# Altium project SINUX_V3.PrjPcb
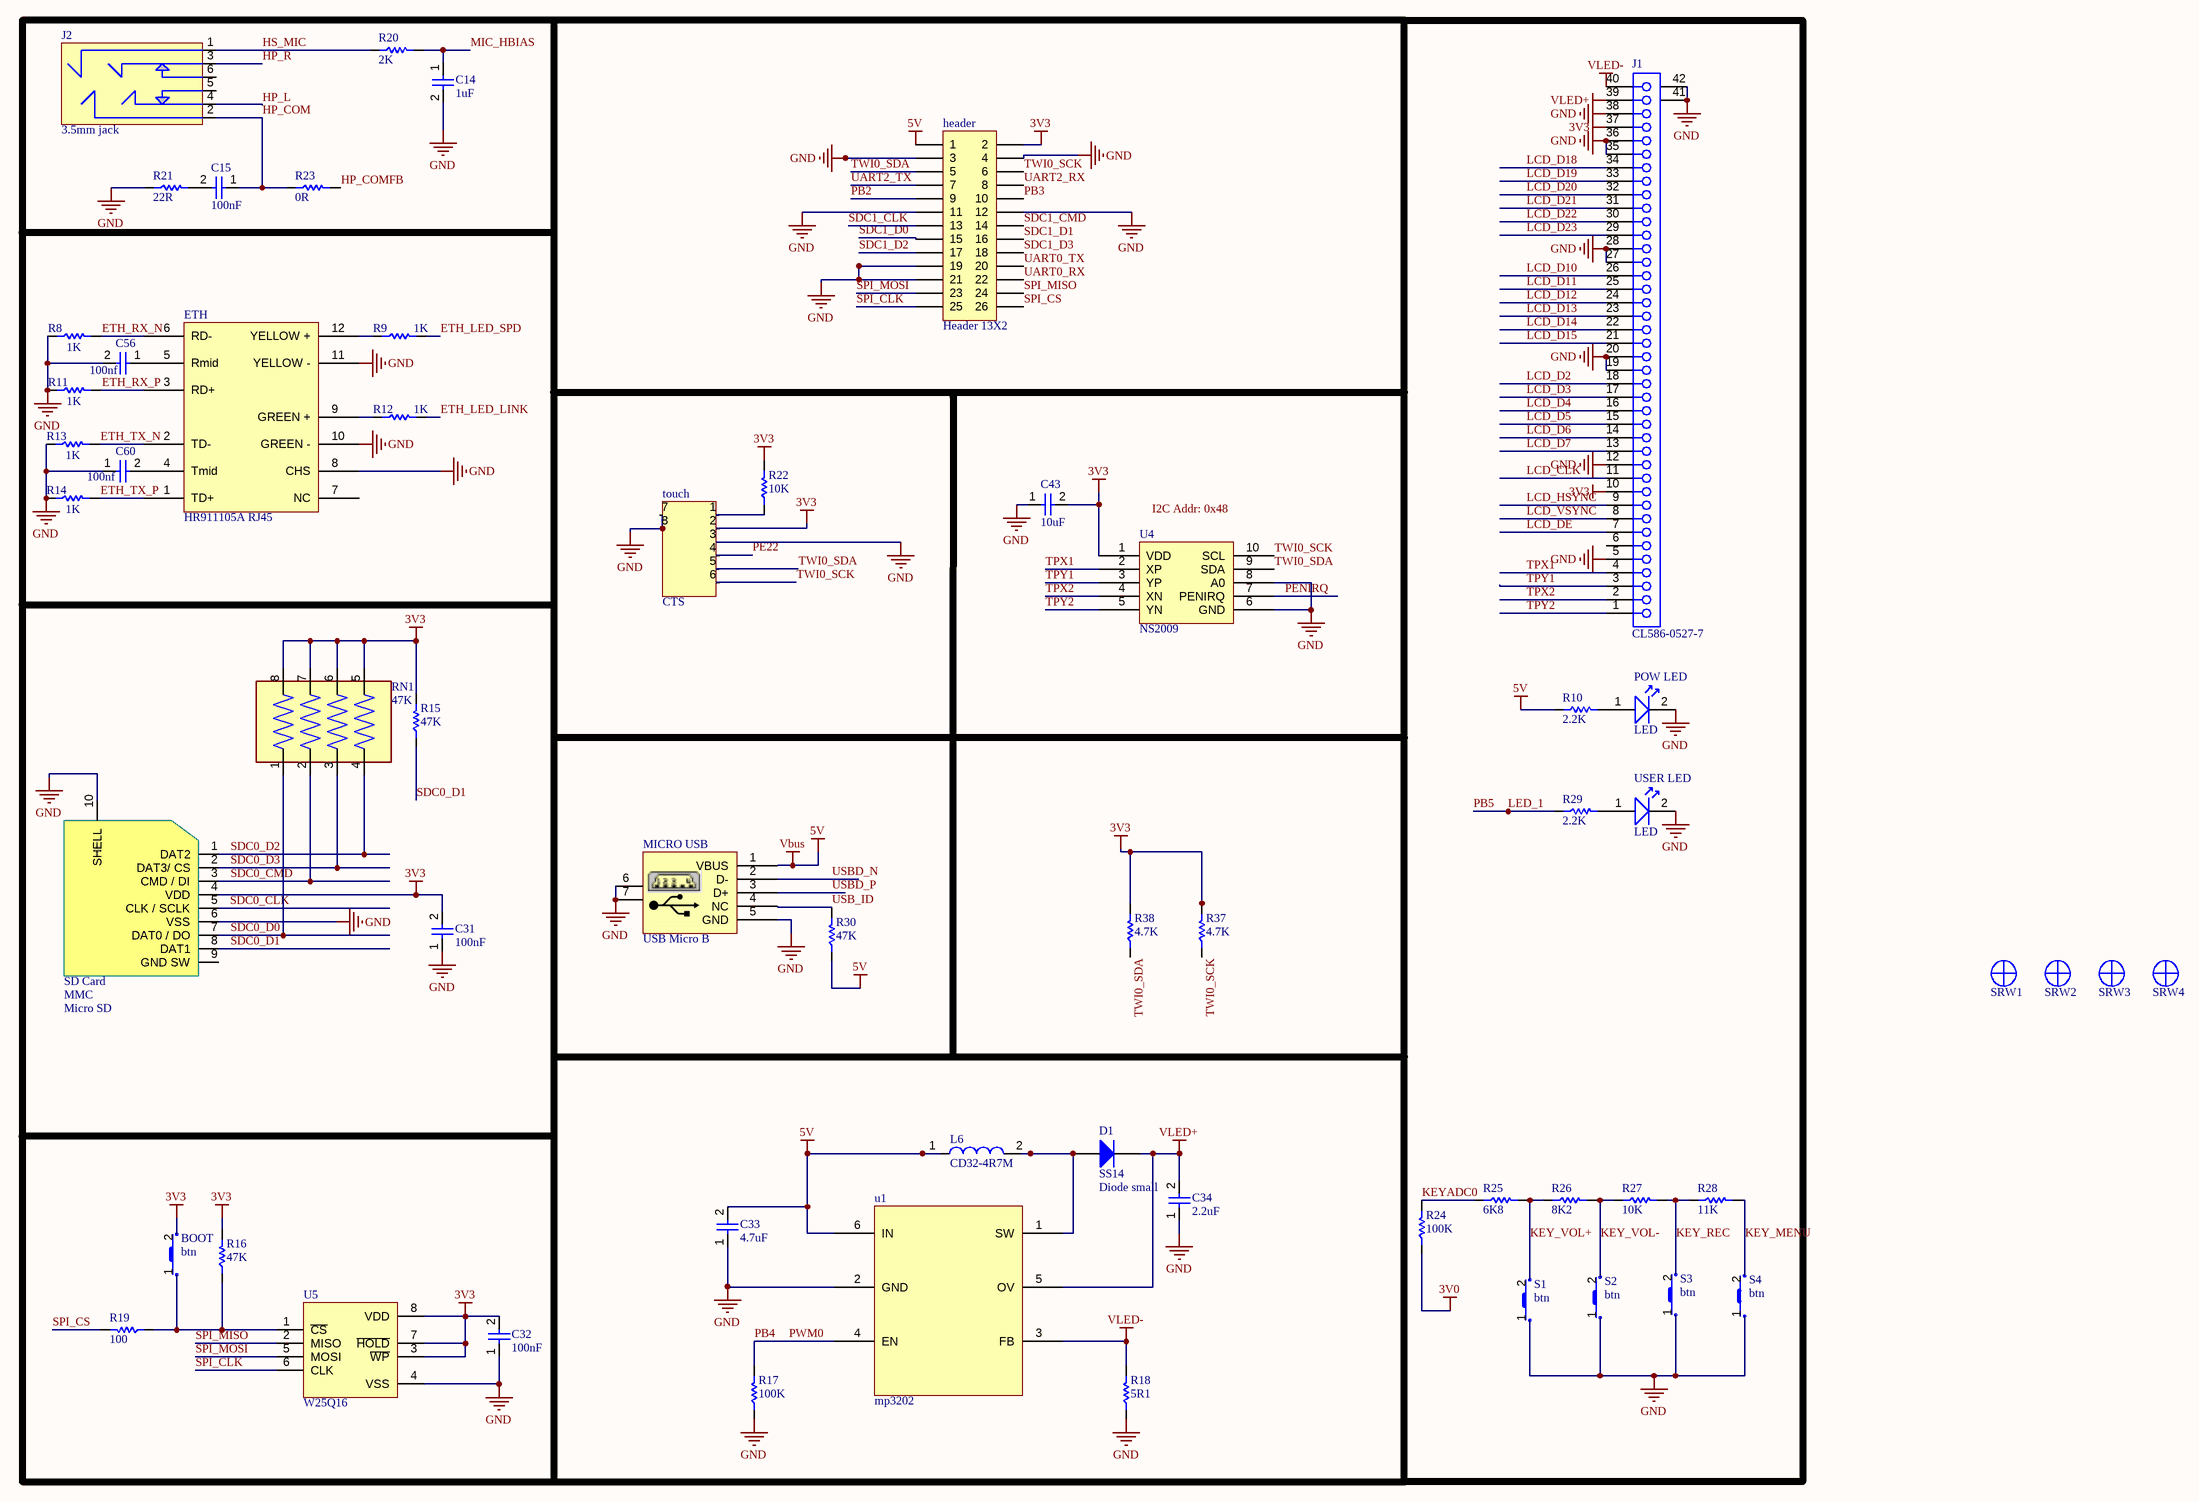
[diagram p0: SINUX_V3_IO.SchDoc]
3 sheets, 131 parts. Net scope: global (net labels, ports and power ports of the same name join across sheets).
Board file: SINUX_V3.PcbDoc
Sheets:
  SINUX_V3_IO.SchDoc
  SINUX_V3_MAIN.SchDoc
  SINUX_V3_POWER.SchDoc

## Sheet SINUX_V3_IO.SchDoc
size 594 x 420 mm

### Parts
BOOT  btn  [btn]
C14  1uF  [SMD 0805]
C15  100nF  [SMD 0805]
C31  100nF  [SMD 0805]
C32  100nF  [SMD 0805]
C33  4.7uF  [SMD 0805]
C34  2.2uF  [SMD 0805]
C43  10uF  [SMD 0805]
C56  100nf  [SMD 0805]
C60  100nf  [SMD 0805]
D1  SS14  [Diode small SMD]
ETH  HR911105A RJ45  [HR911105A]
header  Header 13X2  [HDR2X13]
J1  CL586-0527-7  [FH12-40S-0.5SH]
J2  3.5mm jack  [3.5mm jack 6 pin]
L6  CD32-4R7M  [CD324R7M]
MICRO_USB  USB Micro B  [USB mini]
POW_LED  LED  [0805 LED]
R8  1K  [0805_1/8W]
R9  1K  [0805_1/8W]
R10  2.2K  [0805_1/8W]
R11  1K  [0805_1/8W]
R12  1K  [0805_1/8W]
R13  1K  [0805_1/8W]
R14  1K  [0805_1/8W]
R15  47K  [0805_1/8W]
R16  47K  [0805_1/8W]
R17  100K  [0805_1/8W]
R18  5R1  [0805_1/8W]
R19  100  [0805_1/8W]
R20  2K  [0805_1/8W]
R21  22R  [0805_1/8W]
R22  10K  [0805_1/8W]
R23  0R  [0805_1/8W]
R24  100K  [0805_1/8W]
R25  6K8  [0805_1/8W]
R26  8K2  [0805_1/8W]
R27  10K  [0805_1/8W]
R28  11K  [0805_1/8W]
R29  2.2K  [0805_1/8W]
R30  47K  [0805_1/8W]
R37  4.7K  [0805_1/8W]
R38  4.7K  [0805_1/8W]
RN1  47K  [RESCAF80P320X160X60-8N]
S1  btn  [btn]
S2  btn  [btn]
S3  btn  [btn]
S4  btn  [btn]
SD_Card  MMC  [Micro SD holder]
SRW1  Screw  [Board Screw]  (value not drawn)
SRW2  Screw  [Board Screw]  (value not drawn)
SRW3  Screw  [Board Screw]  (value not drawn)
SRW4  Screw  [Board Screw]  (value not drawn)
touch  CTS  [TS]
u1  mp3202  [SOP95P275X110-6N]
U4  NS2009  [SOP50P490X110-11N]
U5  W25Q16  [SOIC 8-Lead  (5.08mm)]
USER_LED  LED  [0805 LED]

### Nets
3V0: R24.1
3V3: BOOT.2 C31.2 C32.2 C43.2 header.2 J1.10 J1.37 R15.2 R16.2 R22.2 R37.2 R38.2 RN1.5 RN1.6 RN1.7 RN1.8 SD_Card.4(VDD) touch.2 U4.1(VDD) U5.3(~{WP}) U5.7(~{HOLD}) U5.8(VDD)
5V: C33.2 header.1 L6.1 MICRO_USB.1(VBUS) R10.1 R30.1 u1.6(IN)  [also labelled Vbus]
GND: C14.2 C31.1 C32.1 C33.1 C34.1 C43.1 C56.2 C60.1 ETH.8(CHS) ETH.10(GREEN_-) ETH.11(YELLOW_-) header.3 header.4 header.11 header.12 header.19 header.21 J1.5 J1.12 J1.19 J1.20 J1.27 J1.28 J1.35 J1.36 J1.38 J1.41(MH1) J1.42(MH2) MICRO_USB.5(GND) MICRO_USB.6 MICRO_USB.7 POW_LED.2 R8.1 R11.1 R13.1 R14.1 R17.1 R18.1 R21.1 S1.1 S2.1 S3.1 S4.1 SD_Card.6(VSS) SD_Card.10(SHELL) touch.3 touch.7 touch.8 u1.2(GND) U4.6(GND) U4.8(A0) U5.4(VSS) USER_LED.2
VLED+: C34.2 D1.2(K) J1.39 u1.5(OV)
VLED-: J1.40 R18.2 u1.3(FB)
ETH_LED_LINK: R12.2
ETH_LED_SPD: R9.2
ETH_RX_N: ETH.6(RD-) R8.2
ETH_RX_P: ETH.3(RD+) R11.2
ETH_TX_N: ETH.2(TD-) R13.2
ETH_TX_P: ETH.1(TD+) R14.2
HP_COM: C15.1 J2.2 R23.1
HP_COMFB: R23.2
HP_L: J2.4
HP_R: J2.3
HS_MIC: J2.1 R20.1
KEY_MENU: R28.2 S4.2
KEY_REC: R27.2 R28.1 S3.2
KEY_VOL+: R25.2 R26.1 S1.2
KEY_VOL-: R26.2 R27.1 S2.2
KEYADC0: R24.2 R25.1
LCD_CLK: J1.11
LCD_D2: J1.18
LCD_D3: J1.17
LCD_D4: J1.16
LCD_D5: J1.15
LCD_D6: J1.14
LCD_D7: J1.13
LCD_D10: J1.26
LCD_D11: J1.25
LCD_D12: J1.24
LCD_D13: J1.23
LCD_D14: J1.22
LCD_D15: J1.21
LCD_D18: J1.34
LCD_D19: J1.33
LCD_D20: J1.32
LCD_D21: J1.31
LCD_D22: J1.30
LCD_D23: J1.29
LCD_DE: J1.7
LCD_HSYNC: J1.9
LCD_VSYNC: J1.8
LED_1: R29.1  [also labelled PB5]
MIC_HBIAS: C14.1 R20.2
PB2: header.9
PB3: header.10
PB4: R17.2 u1.4(EN)  [also labelled PWM0]
PE22: touch.4
PENIRQ: U4.7(PENIRQ)
SDC0_CLK: SD_Card.5(CLK_/_SCLK)
SDC0_CMD: RN1.2 SD_Card.3(CMD_/_DI)
SDC0_D0: RN1.1 SD_Card.7(DAT0_/_DO)
SDC0_D1: R15.1 SD_Card.8(DAT1)
SDC0_D2: RN1.4 SD_Card.1(DAT2)
SDC0_D3: RN1.3 SD_Card.2(DAT3/_CS)
SDC1_CLK: header.13
SDC1_CMD: header.14
SDC1_D0: header.15
SDC1_D1: header.16
SDC1_D2: header.17
SDC1_D3: header.18
SPI_CLK: header.25 U5.6(CLK)
SPI_CS: header.26 R19.2
SPI_MISO: header.24 U5.2(MISO)
SPI_MOSI: header.23 U5.5(MOSI)
TPX1: J1.4 U4.2(XP)
TPX2: J1.2 U4.4(XN)
TPY1: J1.3 U4.3(YP)
TPY2: J1.1 U4.5(YN)
TWI0_SCK: header.6 R37.1 touch.6 U4.10(SCL)
TWI0_SDA: header.5 R38.1 touch.5 U4.9(SDA)
UART0_RX: header.22
UART0_TX: header.20
UART2_RX: header.8
UART2_TX: header.7
USB_ID: MICRO_USB.4(NC) R30.2
USBD_N: MICRO_USB.2(D-)
USBD_P: MICRO_USB.3(D+)
NetBOOT_1: BOOT.1 R16.1 R19.1 U5.1(~{CS})
NetC15_2: C15.2 R21.2
NetC56_1: C56.1 ETH.5(Rmid)
NetC60_2: C60.2 ETH.4(Tmid)
NetD1_1: D1.1(A) L6.2 u1.1(SW)
NetETH_9: ETH.9(GREEN_+) R12.1
NetETH_12: ETH.12(YELLOW_+) R9.1
NetPOW_LED_1: POW_LED.1 R10.2
NetR22_1: R22.1 touch.1
NetR29_2: R29.2 USER_LED.1

Not connected (* = marked no-connect by the designer): ETH 7(NC); J1 6; J2 5 6; SD_Card 9(GND_SW)

### Notes on the sheet
- Labels drawn without touching a wire or pin: I2C Addr: 0x48
- DWG NO:
- REV:
- THIS DOCUMENT AND THE DATA DISCLOSED HEREIN OR
- HEREWITH IS THE PROPERTY OF ALTIUM LIMITED AND MAY
- BE FREELY DISTRIBUTED IN WHOLE. NO RIGHTS ARE
- RESERVED OR EXPRESS OR IMPLIED WARANTEE GIVEN.
- REVISION
- DESCRIPTION
- DATE
- APPROVED
- ENG:
- APPROVALS
- PROJECT
- DSN:
- CHK:
- REFERENCE DOCUMENTS
- PROJECT REVISION:
- TITLE
- DOCUMENT REVISION:
- DESIGN ITEM:
- BOM:
- FAB DWG:
- PCB DWG:
- ASSY DWG:
- SCALE:
- A2
- SIZE
- CAGE CODE
- FILE NAME
- DWG NO.
- SHEET
- OF
- REV
- (in symbol Diode) Diode small
- (in symbol MMC) Micro SD

### Library data of the parts
C14 C15 C32-C34 = CAP NON: Capacitor; Manufacturer Part Number 1: 10uF; Supplier 1: SMD-0805
C31 C43 C56 C60 = CAP NON
D1 = Diode
header = Header 13X2: Header, 13-Pin, Dual row; LatestRevisionDate: 17-Jul-2002; LatestRevisionNote: Re-released for DXP Platform.; Publisher: Altium Limited
J1 = CL586-0527-7: FH12 Series, "Flip-Lock" SMT/ZIF FFC/FPC Connector - 0.5mm Spaced Bottom Contact; Positions: 40; ContactMaterial: Phosphor Bronze; Current: 0.4A; PCB_Layout: Complies with manufacturer's recommendation.; Published: 17-Jul-2002; DatasheetVersion: 13-Nov-2000; PackageVersion: 13-Nov-2000; PackageReference: FH12-40S-0.5SH; Publisher: Altium Limited; PadDimensions: Follow nominal values, Suitable for Wave Soldering, Adjust for Re-flow.; ComponentLink1Description: Manufacturer Link; ComponentLink1URL: http://www.hiroseusa.com/; ComponentLink2Description: Datasheet; ComponentLink2URL: http://www.hirose.co.jp/cataloge_hp/e58605370.pdf
L6 = CD32-4R7M: Inductor; Manufacturer_Name: Shuo Xing; Datasheet Link: http://aitendo3.sakura.ne.jp/aitendo_data/product_img/parts/coil/CD32/CD32.pdf; Height: 2.4mm; Manufacturer_Part_Number: CD32-4R7M
R8-R30 R37 R38 = RESISTOR
RN1 = CAY16-270J4LF: 27 Ohm Â±5% 62.5mW Power Per Element Isolated Resistor Network/Array Â±200ppm/Â°C 1206 (3216 Metric), Convex, Long Side Terminals; MF: Bourns; Purchase-URL: https://pricing.snapeda.com/search/part/CAY16-270J4LF/?ref=eda; MP: CAY16-270J4LF; Package: 1206 Bourns; Price: None; Availability: Good; SnapEDA_Link: https://www.snapeda.com/parts/CAY16-270J4LF/Bourns/view-part/1118422/?ref=snap; Value: *; Check_prices: https://www.snapeda.com/parts/CAY16-270J4LF/Bourns/view-part/1118422/?ref=eda
SRW1-SRW4 = Board Screw 3MM: Board Screw With Spacer
U5 = SST25VF032: SERIAL FLASH MEMORY; Manufacturer Part Number 1: W25Q32JV-DTR; Manufacturer 1: Winbond; Supplier 1: 8-Pin SOIC 208-mil

## Sheet SINUX_V3_MAIN.SchDoc
size 594 x 420 mm
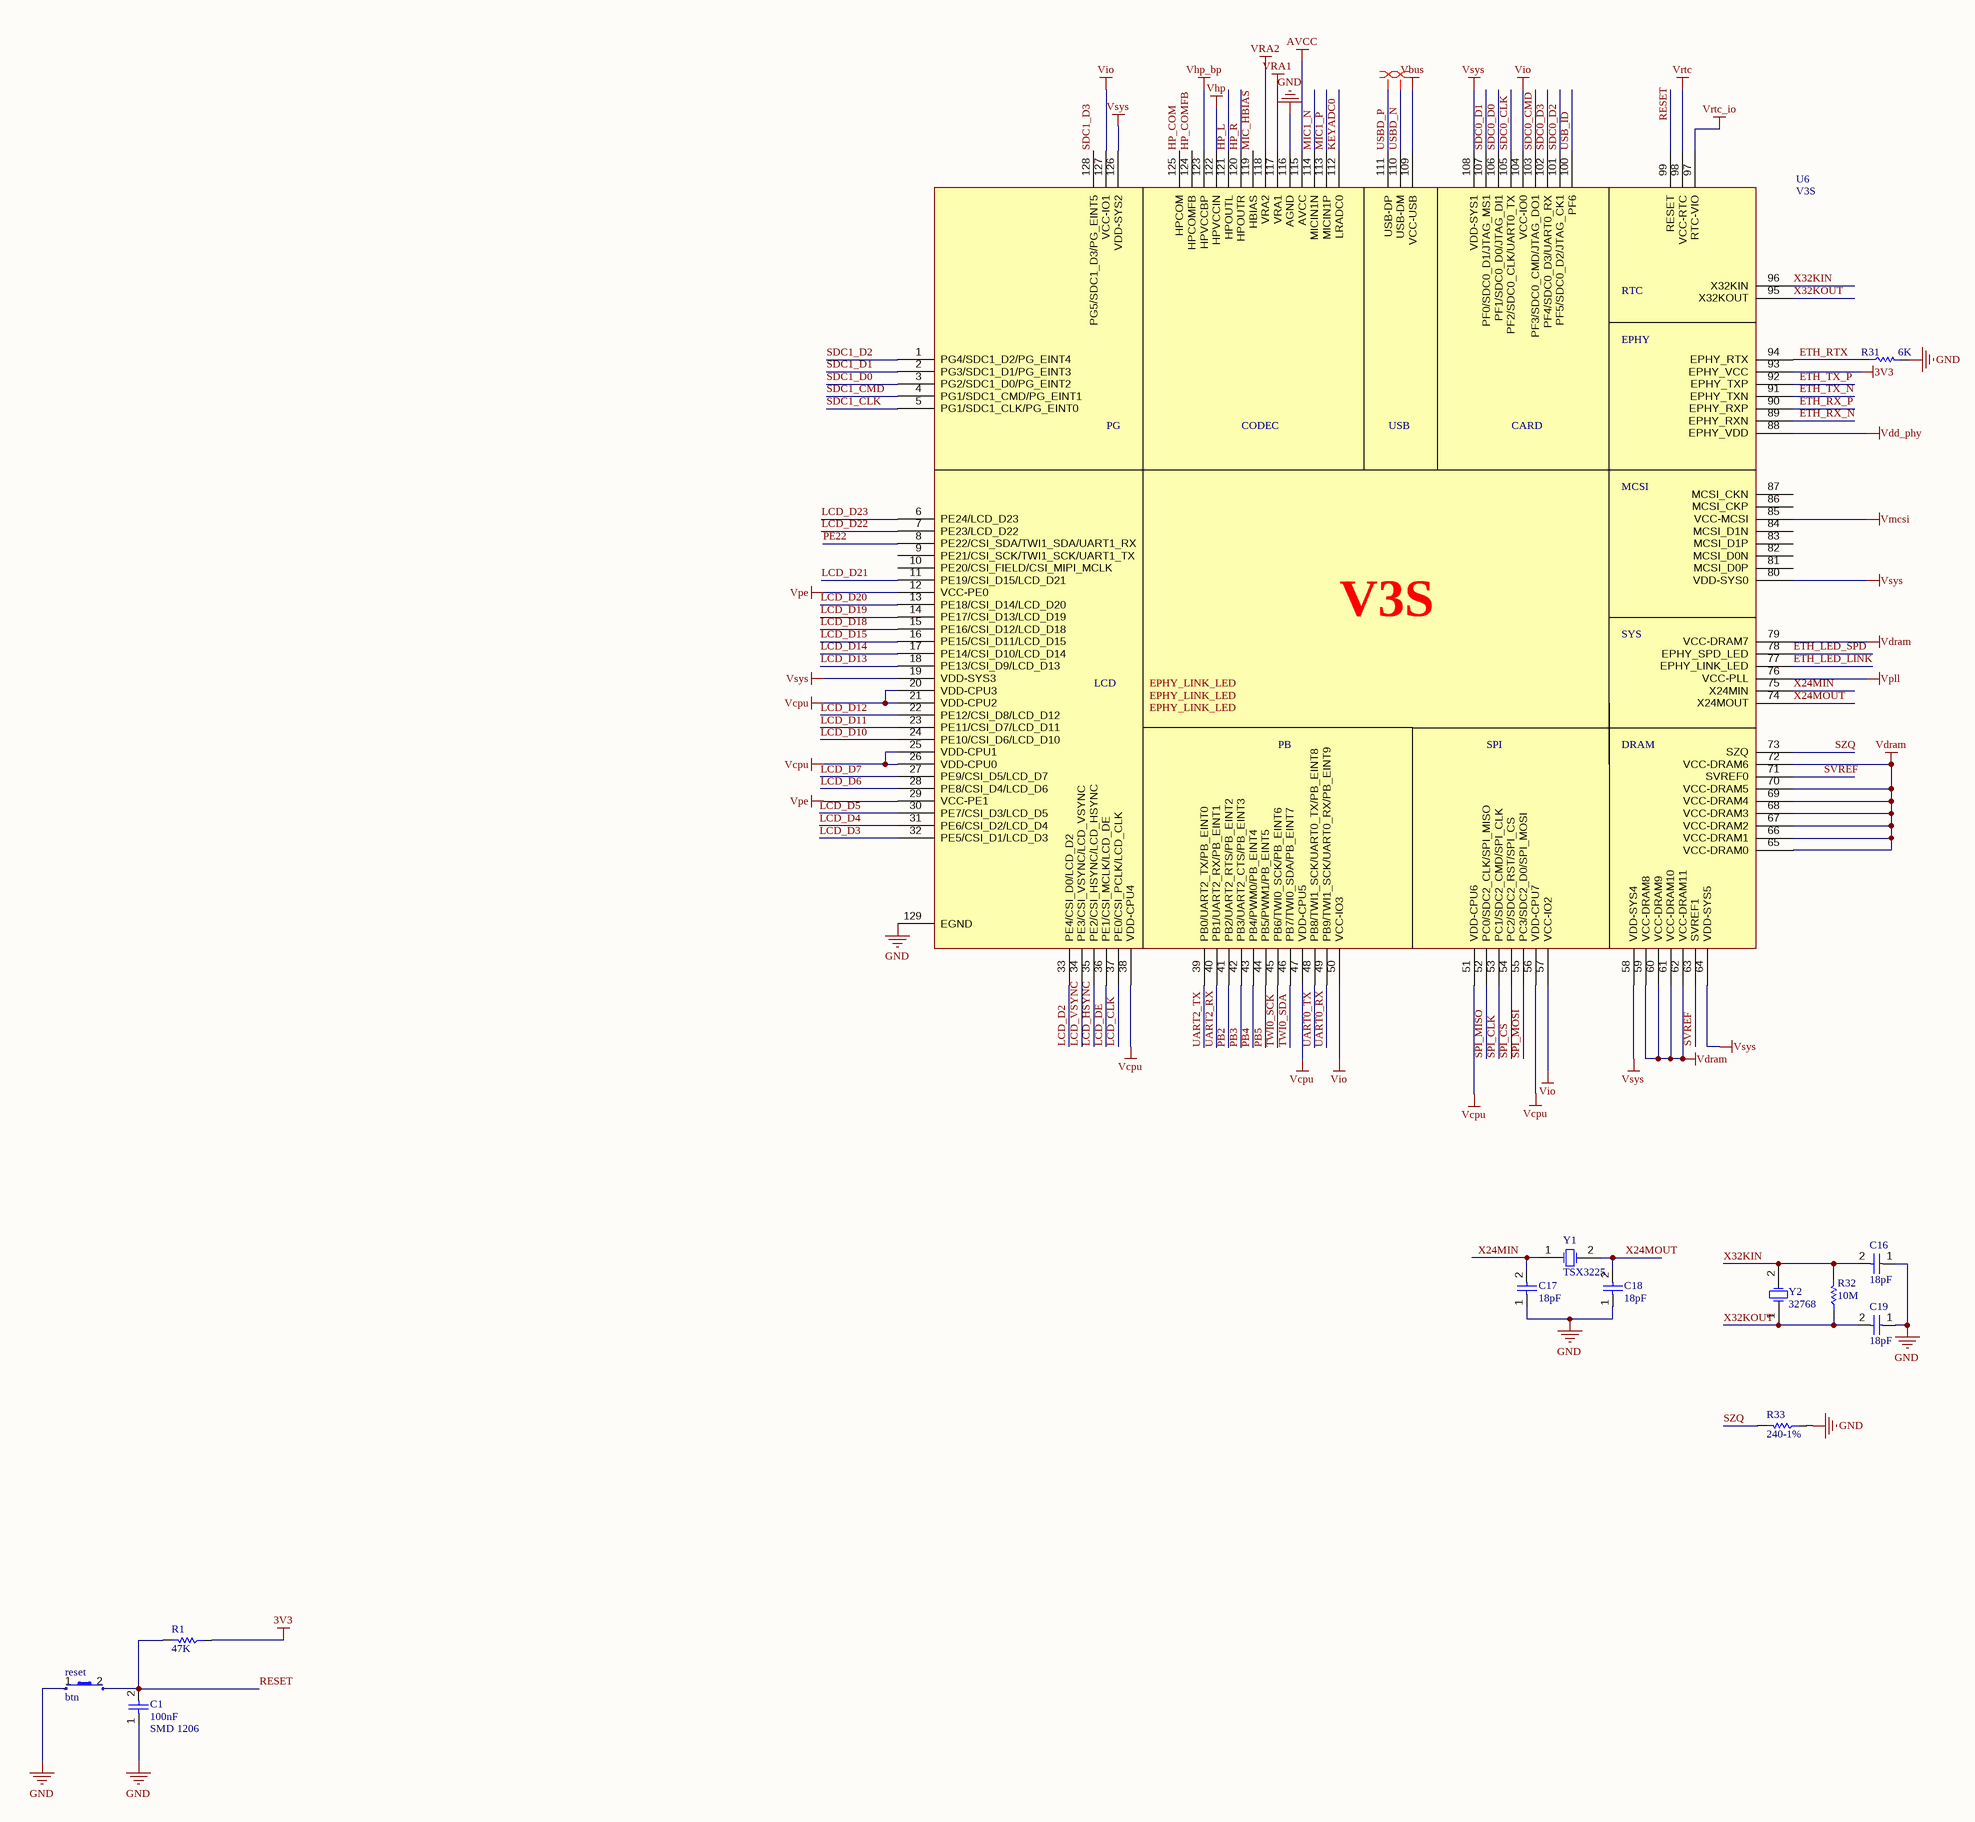
[diagram p1: SINUX_V3_MAIN.SchDoc]

### Parts
C1  100nF  [SMD 0805]
C16  18pF  [SMD 0805]
C17  18pF  [SMD 0805]
C18  18pF  [SMD 0805]
C19  18pF  [SMD 0805]
R1  47K  [0805_1/8W]
R31  6K  [0805_1/8W]
R32  10M  [0805_1/8W]
R33  240-1%  [0805_1/8W]
reset  btn  [btn]
U6  V3S  [V3S]
Y1  TSX3225  [XTAL  SMD]
Y2  32768  [XTAL RTC]

### Nets
3V3: R1.1 U6.12(VCC-PE0) U6.29(VCC-PE1) U6.50(VCC-IO3) U6.57(VCC-IO2) U6.85(VCC-MCSI) U6.93(EPHY_VCC) U6.98(VCC-RTC) U6.104(VCC-IO0) U6.122(HPVCCIN) U6.127(VCC-IO1)  [also labelled Vhp, Vio, Vmcsi, Vpe, Vrtc]
AVCC: U6.76(VCC-PLL) U6.115(AVCC)  [also labelled Vpll]  [project net 3V0]
GND: C1.1 C16.1 C17.1 C18.1 C19.1 R31.2 R33.1 reset.1 U6.116(AGND) U6.129(EGND)
Vbus: U6.109(VCC-USB)  [project net 5V]
Vcpu: U6.19(VDD-SYS3) U6.20(VDD-CPU3) U6.21(VDD-CPU2) U6.25(VDD-CPU1) U6.26(VDD-CPU0) U6.38(VDD-CPU4) U6.47(VDD-CPU5) U6.51(VDD-CPU6) U6.56(VDD-CPU7) U6.58(VDD-SYS4) U6.64(VDD-SYS5) U6.80(VDD-SYS0) U6.88(EPHY_VDD) U6.108(VDD-SYS1) U6.126(VDD-SYS2)  [also labelled Vdd_phy, Vsys]  [project net 1V2]
Vdram: U6.59(VCC-DRAM8) U6.60(VCC-DRAM9) U6.61(VCC-DRAM10) U6.62(VCC-DRAM11) U6.65(VCC-DRAM0) U6.66(VCC-DRAM1) U6.67(VCC-DRAM2) U6.68(VCC-DRAM3) U6.69(VCC-DRAM4) U6.70(VCC-DRAM5) U6.72(VCC-DRAM6) U6.79(VCC-DRAM7)  [project net 1V8]
Vhp_bp: U6.123(HPVCCBP)
VRA1: U6.117(VRA1)
VRA2: U6.118(VRA2)
Vrtc_io: U6.97(RTC-VIO)
ETH_LED_LINK: U6.77(EPHY_LINK_LED)
ETH_LED_SPD: U6.78(EPHY_SPD_LED)
ETH_RTX: R31.1 U6.94(EPHY_RTX)
ETH_RX_N: U6.89(EPHY_RXN)
ETH_RX_P: U6.90(EPHY_RXP)
ETH_TX_N: U6.91(EPHY_TXN)
ETH_TX_P: U6.92(EPHY_TXP)
HP_COM: U6.125(HPCOM)
HP_COMFB: U6.124(HPCOMFB)
HP_L: U6.121(HPOUTL)
HP_R: U6.120(HPOUTR)
KEYADC0: U6.112(LRADC0)
LCD_CLK: U6.37(PE0/CSI_PCLK/LCD_CLK)
LCD_D2: U6.33(PE4/CSI_D0/LCD_D2)
LCD_D3: U6.32(PE5/CSI_D1/LCD_D3)
LCD_D4: U6.31(PE6/CSI_D2/LCD_D4)
LCD_D5: U6.30(PE7/CSI_D3/LCD_D5)
LCD_D6: U6.28(PE8/CSI_D4/LCD_D6)
LCD_D7: U6.27(PE9/CSI_D5/LCD_D7)
LCD_D10: U6.24(PE10/CSI_D6/LCD_D10)
LCD_D11: U6.23(PE11/CSI_D7/LCD_D11)
LCD_D12: U6.22(PE12/CSI_D8/LCD_D12)
LCD_D13: U6.18(PE13/CSI_D9/LCD_D13)
LCD_D14: U6.17(PE14/CSI_D10/LCD_D14)
LCD_D15: U6.16(PE15/CSI_D11/LCD_D15)
LCD_D18: U6.15(PE16/CSI_D12/LCD_D18)
LCD_D19: U6.14(PE17/CSI_D13/LCD_D19)
LCD_D20: U6.13(PE18/CSI_D14/LCD_D20)
LCD_D21: U6.11(PE19/CSI_D15/LCD_D21)
LCD_D22: U6.7(PE23/LCD_D22)
LCD_D23: U6.6(PE24/LCD_D23)
LCD_DE: U6.36(PE1/CSI_MCLK/LCD_DE)
LCD_HSYNC: U6.35(PE2/CSI_HSYNC/LCD_HSYNC)
LCD_VSYNC: U6.34(PE3/CSI_VSYNC/LCD_VSYNC)
MIC1_N: U6.114(MICIN1N)
MIC1_P: U6.113(MICIN1P)
MIC_HBIAS: U6.119(HBIAS)
PB2: U6.41(PB2/UART2_RTS/PB_EINT2)
PB3: U6.42(PB3/UART2_CTS/PB_EINT3)
PB4: U6.43(PB4/PWM0/PB_EINT4)
PB5: U6.44(PB5/PWM1/PB_EINT5)  [project net LED_1]
PE22: U6.8(PE22/CSI_SDA/TWI1_SDA/UART1_RX)
RESET: C1.2 R1.2 reset.2 U6.99(RESET)
SDC0_CLK: U6.105(PF2/SDC0_CLK/UART0_TX)
SDC0_CMD: U6.103(PF3/SDC0_CMD/JTAG_DO1)
SDC0_D0: U6.106(PF1/SDC0_D0/JTAG_DI1)
SDC0_D1: U6.107(PF0/SDC0_D1/JTAG_MS1)
SDC0_D2: U6.101(PF5/SDC0_D2/JTAG_CK1)
SDC0_D3: U6.102(PF4/SDC0_D3/UART0_RX)
SDC1_CLK: U6.5(PG1/SDC1_CLK/PG_EINT0)
SDC1_CMD: U6.4(PG1/SDC1_CMD/PG_EINT1)
SDC1_D0: U6.3(PG2/SDC1_D0/PG_EINT2)
SDC1_D1: U6.2(PG3/SDC1_D1/PG_EINT3)
SDC1_D2: U6.1(PG4/SDC1_D2/PG_EINT4)
SDC1_D3: U6.128(PG5/SDC1_D3/PG_EINT5)
SPI_CLK: U6.53(PC1/SDC2_CMD/SPI_CLK)
SPI_CS: U6.54(PC2/SDC2_RST/SPI_CS)
SPI_MISO: U6.52(PC0/SDC2_CLK/SPI_MISO)
SPI_MOSI: U6.55(PC3/SDC2_D0/SPI_MOSI)
SVREF: U6.63(SVREF1) U6.71(SVREF0)
SZQ: R33.2 U6.73(SZQ)
TWI0_SCK: U6.45(PB6/TWI0_SCK/PB_EINT6)
TWI0_SDA: U6.46(PB7/TWI0_SDA/PB_EINT7)
UART0_RX: U6.49(PB9/TWI1_SCK/UART0_RX/PB_EINT9)
UART0_TX: U6.48(PB8/TWI1_SCK/UART0_TX/PB_EINT8)
UART2_RX: U6.40(PB1/UART2_RX/PB_EINT1)
UART2_TX: U6.39(PB0/UART2_TX/PB_EINT0)
USB_ID: U6.100(PF6)
USBD_N: U6.110(USB-DM)
USBD_P: U6.111(USB-DP)
X24MIN: C17.2 U6.75(X24MIN) Y1.1(OSC1)
X24MOUT: C18.2 U6.74(X24MOUT) Y1.2(OSC2)
X32KIN: C16.2 R32.2 U6.96(X32KIN) Y2.2(OSC2)
X32KOUT: C19.2 R32.1 U6.95(X32KOUT) Y2.1(OSC1)

Not connected (* = marked no-connect by the designer): U6 9(PE21/CSI_SCK/TWI1_SCK/UART1_TX) 10(PE20/CSI_FIELD/CSI_MIPI_MCLK) 81(MCSI_D0P) 82(MCSI_D0N) 83(MCSI_D1P) 84(MCSI_D1N) 86(MCSI_CKP) 87(MCSI_CKN)

### Layout directives
differential pair: USBD_N, USBD_P

### Notes on the sheet
- Labels drawn without touching a wire or pin: EPHY_LINK_LED
- DWG NO:
- REV:
- THIS DOCUMENT AND THE DATA DISCLOSED HEREIN OR
- HEREWITH IS THE PROPERTY OF ALTIUM LIMITED AND MAY
- BE FREELY DISTRIBUTED IN WHOLE. NO RIGHTS ARE
- RESERVED OR EXPRESS OR IMPLIED WARANTEE GIVEN.
- REVISION
- DESCRIPTION
- DATE
- APPROVED
- ENG:
- APPROVALS
- PROJECT
- DSN:
- CHK:
- REFERENCE DOCUMENTS
- PROJECT REVISION:
- TITLE
- DOCUMENT REVISION:
- DESIGN ITEM:
- BOM:
- FAB DWG:
- PCB DWG:
- ASSY DWG:
- SCALE:
- A2
- SIZE
- CAGE CODE
- FILE NAME
- DWG NO.
- SHEET
- OF
- REV
- (in symbol CAP NON) SMD 1206
- (in symbol V3S) RTC; EPHY; PG; CODEC; USB; CARD; MCSI; SYS; LCD; PB; SPI; DRAM

### Library data of the parts
C1 C16-C19 = CAP NON
R1 R31-R33 = RESISTOR
Y1 Y2 = XTAL

## Sheet SINUX_V3_POWER.SchDoc
size 594 x 420 mm
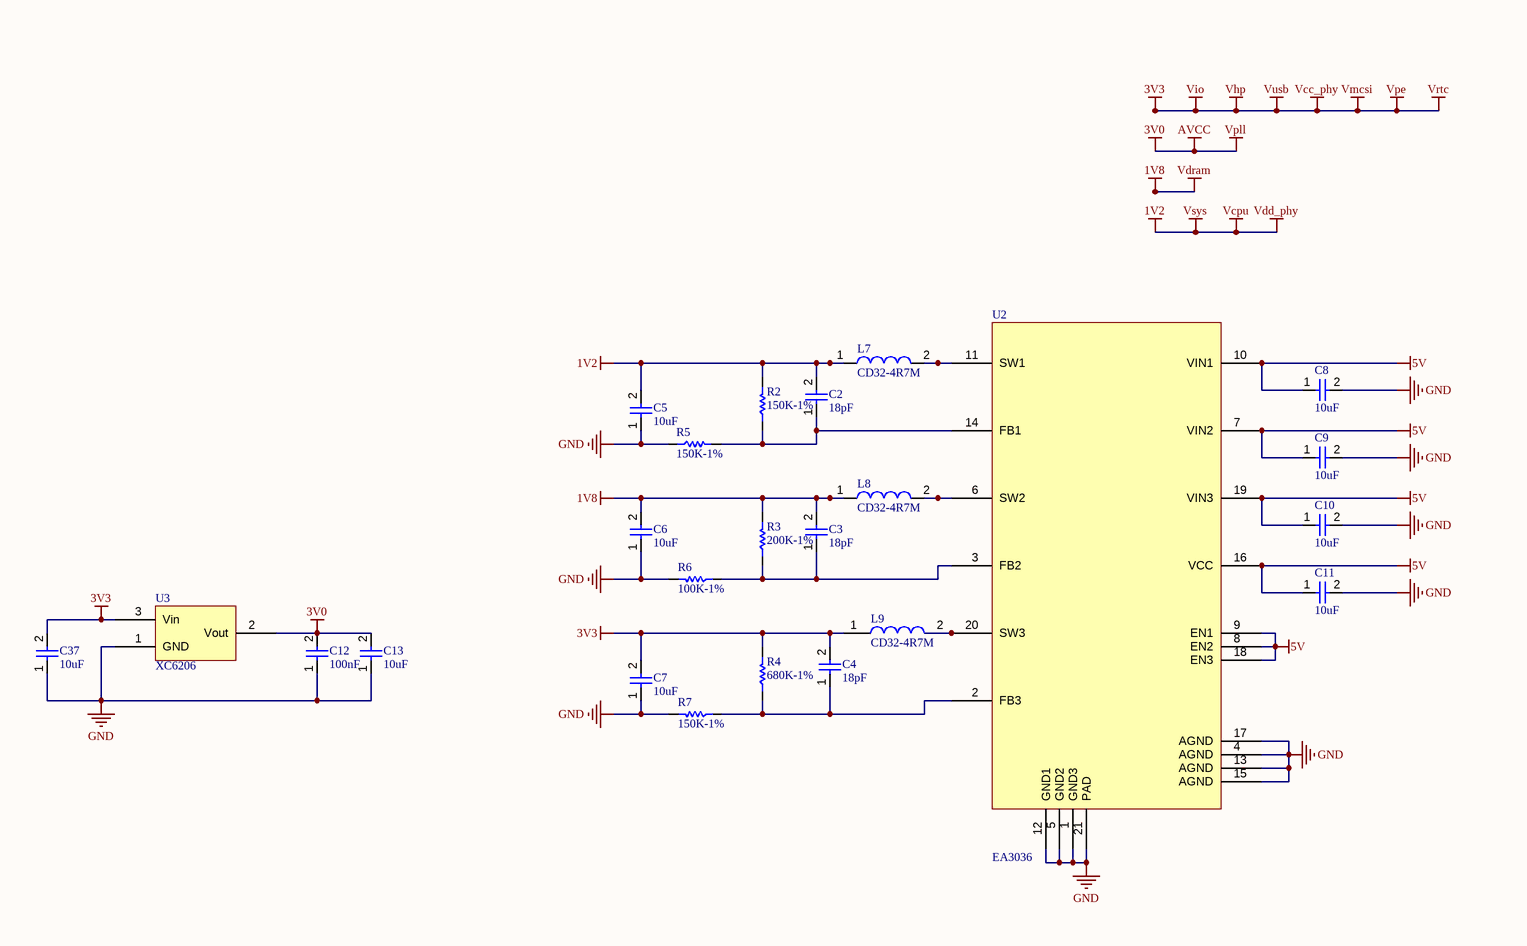
[diagram p2: SINUX_V3_POWER.SchDoc, left]
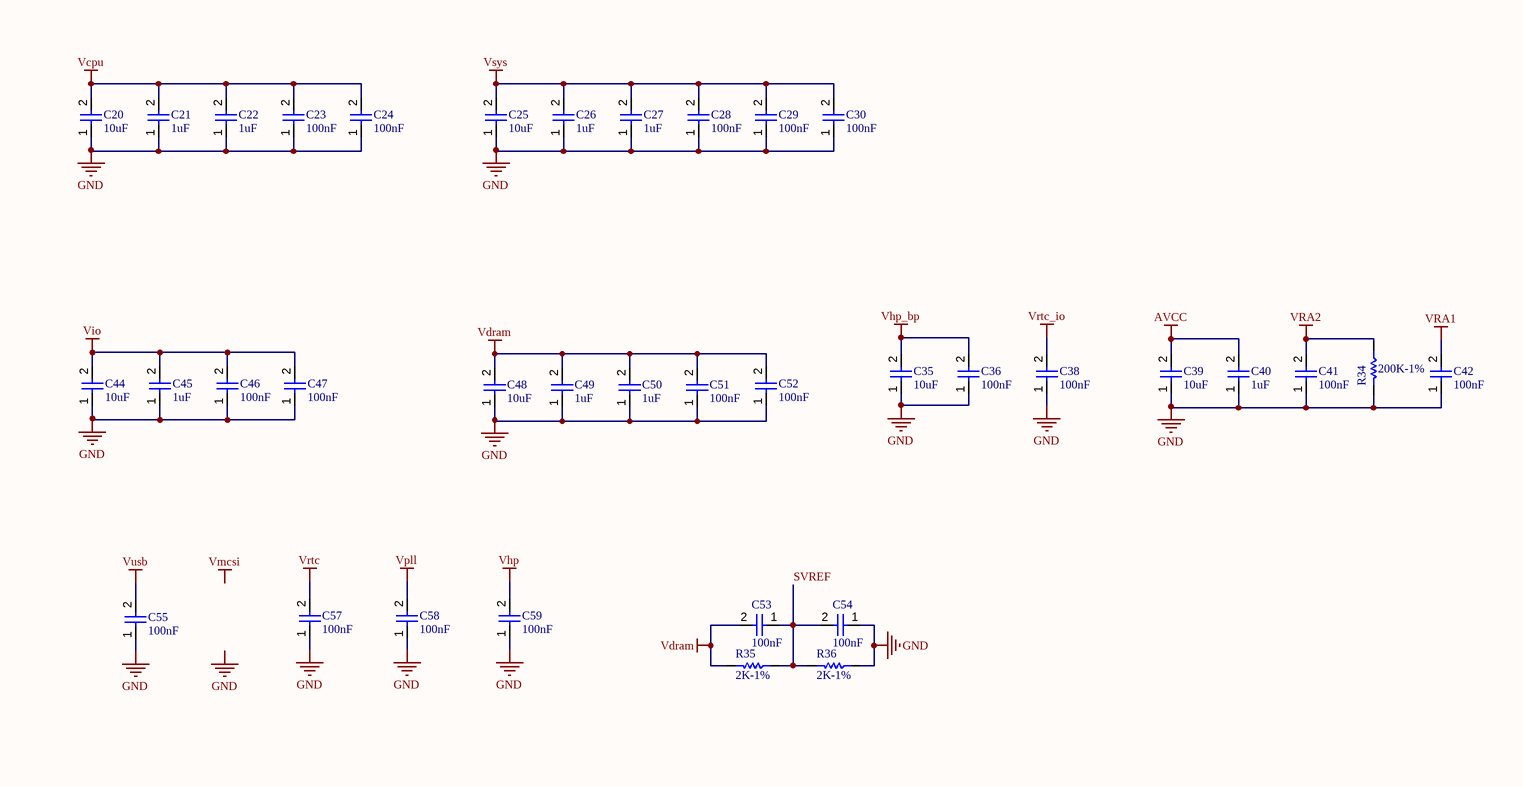
[diagram p3: SINUX_V3_POWER.SchDoc, right]

### Parts
C2  18pF  [SMD 0805]
C3  18pF  [SMD 0805]
C4  18pF  [SMD 0805]
C5  10uF  [SMD 0805]
C6  10uF  [SMD 0805]
C7  10uF  [SMD 0805]
C8  10uF  [SMD 0805]
C9  10uF  [SMD 0805]
C10  10uF  [SMD 0805]
C11  10uF  [SMD 0805]
C12  100nF  [SMD 0805]
C13  10uF  [SMD 0805]
C20  10uF  [SMD 0805]
C21  1uF  [SMD 0805]
C22  1uF  [SMD 0805]
C23  100nF  [SMD 0805]
C24  100nF  [SMD 0805]
C25  10uF  [SMD 0805]
C26  1uF  [SMD 0805]
C27  1uF  [SMD 0805]
C28  100nF  [SMD 0805]
C29  100nF  [SMD 0805]
C30  100nF  [SMD 0805]
C35  10uF  [SMD 0805]
C36  100nF  [SMD 0805]
C37  10uF  [SMD 0805]
C38  100nF  [SMD 0805]
C39  10uF  [SMD 0805]
C40  1uF  [SMD 0805]
C41  100nF  [SMD 0805]
C42  100nF  [SMD 0805]
C44  10uF  [SMD 0805]
C45  1uF  [SMD 0805]
C46  100nF  [SMD 0805]
C47  100nF  [SMD 0805]
C48  10uF  [SMD 0805]
C49  1uF  [SMD 0805]
C50  1uF  [SMD 0805]
C51  100nF  [SMD 0805]
C52  100nF  [SMD 0805]
C53  100nF  [SMD 0805]
C54  100nF  [SMD 0805]
C55  100nF  [SMD 0805]
C57  100nF  [SMD 0805]
C58  100nF  [SMD 0805]
C59  100nF  [SMD 0805]
L7  CD32-4R7M  [CD324R7M]
L8  CD32-4R7M  [CD324R7M]
L9  CD32-4R7M  [CD324R7M]
R2  150K-1%  [0805_1/8W]
R3  200K-1%  [0805_1/8W]
R4  680K-1%  [0805_1/8W]
R5  150K-1%  [0805_1/8W]
R6  100K-1%  [0805_1/8W]
R7  150K-1%  [0805_1/8W]
R34  200K-1%  [0805_1/8W]
R35  2K-1%  [0805_1/8W]
R36  2K-1%  [0805_1/8W]
U2  EA3036  [QFN40P300X300X80-21N]
U3  XC6206  [SOT95P280X130-3N]

### Nets
1V2: C2.2 C5.2 C20.2 C21.2 C22.2 C23.2 C24.2 C25.2 C26.2 C27.2 C28.2 C29.2 C30.2 L7.1 R2.2  [also labelled Vcpu, Vdd_phy, Vsys]
1V8: C3.2 C6.2 C48.2 C49.2 C50.2 C51.2 C52.2 C53.2 L8.1 R3.2 R35.2  [also labelled Vdram]
3V0: C12.2 C13.2 C39.2 C40.2 C58.2 U3.2(Vout)  [also labelled AVCC, Vpll]
3V3: C4.2 C7.2 C37.2 C44.2 C45.2 C46.2 C47.2 C55.2 C57.2 C59.2 L9.1 R4.2 U3.3(Vin)  [also labelled Vcc_phy, Vhp, Vio, Vmcsi, Vpe, Vrtc, Vusb]
5V: C8.1 C9.1 C10.1 C11.1 U2.7(VIN2) U2.8(EN2) U2.9(EN1) U2.10(VIN1) U2.16(VCC) U2.18(EN3) U2.19(VIN3)
GND: C5.1 C6.1 C7.1 C8.2 C9.2 C10.2 C11.2 C12.1 C13.1 C20.1 C21.1 C22.1 C23.1 C24.1 C25.1 C26.1 C27.1 C28.1 C29.1 C30.1 C35.1 C36.1 C37.1 C38.1 C39.1 C40.1 C41.1 C42.1 C44.1 C45.1 C46.1 C47.1 C48.1 C49.1 C50.1 C51.1 C52.1 C54.1 C55.1 C57.1 C58.1 C59.1 R5.1 R6.2 R7.2 R34.2 R36.1 U2.1(GND3) U2.4(AGND) U2.5(GND2) U2.12(GND1) U2.13(AGND) U2.15(AGND) U2.17(AGND) U2.21(PAD) U3.1(GND)
Vhp_bp: C35.2 C36.2
VRA1: C42.2
VRA2: C41.2 R34.1
Vrtc_io: C38.2
SVREF: C53.1 C54.2 R35.1 R36.2
NetC2_1: C2.1 R2.1 R5.2 U2.14(FB1)
NetC3_1: C3.1 R3.1 R6.1 U2.3(FB2)
NetC4_1: C4.1 R4.1 R7.1 U2.2(FB3)
NetL7_2: L7.2 U2.11(SW1)
NetL8_2: L8.2 U2.6(SW2)
NetL9_2: L9.2 U2.20(SW3)

### Notes on the sheet
- Labels drawn without touching a wire or pin: GND, Vmcsi
- DWG NO:
- REV:
- THIS DOCUMENT AND THE DATA DISCLOSED HEREIN OR
- HEREWITH IS THE PROPERTY OF ALTIUM LIMITED AND MAY
- BE FREELY DISTRIBUTED IN WHOLE. NO RIGHTS ARE
- RESERVED OR EXPRESS OR IMPLIED WARANTEE GIVEN.
- REVISION
- DESCRIPTION
- DATE
- APPROVED
- ENG:
- APPROVALS
- PROJECT
- DSN:
- CHK:
- REFERENCE DOCUMENTS
- PROJECT REVISION:
- TITLE
- DOCUMENT REVISION:
- DESIGN ITEM:
- BOM:
- FAB DWG:
- PCB DWG:
- ASSY DWG:
- SCALE:
- A2
- SIZE
- CAGE CODE
- FILE NAME
- DWG NO.
- SHEET
- OF
- REV

### Library data of the parts
C2-C13 C20-C30 C35-C42 C44-C55 C57-C59 = CAP NON
L7-L9 = CD32-4R7M: Inductor; Manufacturer_Name: Shuo Xing; Datasheet Link: http://aitendo3.sakura.ne.jp/aitendo_data/product_img/parts/coil/CD32/CD32.pdf; Height: 2.4mm; Manufacturer_Part_Number: CD32-4R7M
R2-R7 R34-R36 = RESISTOR

## Nets that join several sheets
1V2: SINUX_V3_MAIN (15 pins), SINUX_V3_POWER (15 pins)
1V8: SINUX_V3_MAIN (12 pins), SINUX_V3_POWER (11 pins)
3V0: SINUX_V3_IO (R24.1), SINUX_V3_MAIN (U6.76 U6.115), SINUX_V3_POWER (6 pins)
3V3: SINUX_V3_IO (22 pins), SINUX_V3_MAIN (11 pins), SINUX_V3_POWER (13 pins)
5V: SINUX_V3_IO (7 pins), SINUX_V3_MAIN (U6.109), SINUX_V3_POWER (11 pins)
GND: SINUX_V3_IO (53 pins), SINUX_V3_MAIN (10 pins), SINUX_V3_POWER (56 pins)
Vhp_bp: SINUX_V3_MAIN (U6.123), SINUX_V3_POWER (C35.2 C36.2)
VRA1: SINUX_V3_MAIN (U6.117), SINUX_V3_POWER (C42.2)
VRA2: SINUX_V3_MAIN (U6.118), SINUX_V3_POWER (C41.2 R34.1)
Vrtc_io: SINUX_V3_MAIN (U6.97), SINUX_V3_POWER (C38.2)
ETH_LED_LINK: SINUX_V3_IO (R12.2), SINUX_V3_MAIN (U6.77)
ETH_LED_SPD: SINUX_V3_IO (R9.2), SINUX_V3_MAIN (U6.78)
ETH_RX_N: SINUX_V3_IO (ETH.6 R8.2), SINUX_V3_MAIN (U6.89)
ETH_RX_P: SINUX_V3_IO (ETH.3 R11.2), SINUX_V3_MAIN (U6.90)
ETH_TX_N: SINUX_V3_IO (ETH.2 R13.2), SINUX_V3_MAIN (U6.91)
ETH_TX_P: SINUX_V3_IO (ETH.1 R14.2), SINUX_V3_MAIN (U6.92)
HP_COM: SINUX_V3_IO (C15.1 J2.2 R23.1), SINUX_V3_MAIN (U6.125)
HP_COMFB: SINUX_V3_IO (R23.2), SINUX_V3_MAIN (U6.124)
HP_L: SINUX_V3_IO (J2.4), SINUX_V3_MAIN (U6.121)
HP_R: SINUX_V3_IO (J2.3), SINUX_V3_MAIN (U6.120)
KEYADC0: SINUX_V3_IO (R24.2 R25.1), SINUX_V3_MAIN (U6.112)
LCD_CLK: SINUX_V3_IO (J1.11), SINUX_V3_MAIN (U6.37)
LCD_D2: SINUX_V3_IO (J1.18), SINUX_V3_MAIN (U6.33)
LCD_D3: SINUX_V3_IO (J1.17), SINUX_V3_MAIN (U6.32)
LCD_D4: SINUX_V3_IO (J1.16), SINUX_V3_MAIN (U6.31)
LCD_D5: SINUX_V3_IO (J1.15), SINUX_V3_MAIN (U6.30)
LCD_D6: SINUX_V3_IO (J1.14), SINUX_V3_MAIN (U6.28)
LCD_D7: SINUX_V3_IO (J1.13), SINUX_V3_MAIN (U6.27)
LCD_D10: SINUX_V3_IO (J1.26), SINUX_V3_MAIN (U6.24)
LCD_D11: SINUX_V3_IO (J1.25), SINUX_V3_MAIN (U6.23)
LCD_D12: SINUX_V3_IO (J1.24), SINUX_V3_MAIN (U6.22)
LCD_D13: SINUX_V3_IO (J1.23), SINUX_V3_MAIN (U6.18)
LCD_D14: SINUX_V3_IO (J1.22), SINUX_V3_MAIN (U6.17)
LCD_D15: SINUX_V3_IO (J1.21), SINUX_V3_MAIN (U6.16)
LCD_D18: SINUX_V3_IO (J1.34), SINUX_V3_MAIN (U6.15)
LCD_D19: SINUX_V3_IO (J1.33), SINUX_V3_MAIN (U6.14)
LCD_D20: SINUX_V3_IO (J1.32), SINUX_V3_MAIN (U6.13)
LCD_D21: SINUX_V3_IO (J1.31), SINUX_V3_MAIN (U6.11)
LCD_D22: SINUX_V3_IO (J1.30), SINUX_V3_MAIN (U6.7)
LCD_D23: SINUX_V3_IO (J1.29), SINUX_V3_MAIN (U6.6)
LCD_DE: SINUX_V3_IO (J1.7), SINUX_V3_MAIN (U6.36)
LCD_HSYNC: SINUX_V3_IO (J1.9), SINUX_V3_MAIN (U6.35)
LCD_VSYNC: SINUX_V3_IO (J1.8), SINUX_V3_MAIN (U6.34)
LED_1: SINUX_V3_IO (R29.1), SINUX_V3_MAIN (U6.44)
MIC_HBIAS: SINUX_V3_IO (C14.1 R20.2), SINUX_V3_MAIN (U6.119)
PB2: SINUX_V3_IO (header.9), SINUX_V3_MAIN (U6.41)
PB3: SINUX_V3_IO (header.10), SINUX_V3_MAIN (U6.42)
PB4: SINUX_V3_IO (R17.2 u1.4), SINUX_V3_MAIN (U6.43)
PE22: SINUX_V3_IO (touch.4), SINUX_V3_MAIN (U6.8)
SDC0_CLK: SINUX_V3_IO (SD_Card.5), SINUX_V3_MAIN (U6.105)
SDC0_CMD: SINUX_V3_IO (RN1.2 SD_Card.3), SINUX_V3_MAIN (U6.103)
SDC0_D0: SINUX_V3_IO (RN1.1 SD_Card.7), SINUX_V3_MAIN (U6.106)
SDC0_D1: SINUX_V3_IO (R15.1 SD_Card.8), SINUX_V3_MAIN (U6.107)
SDC0_D2: SINUX_V3_IO (RN1.4 SD_Card.1), SINUX_V3_MAIN (U6.101)
SDC0_D3: SINUX_V3_IO (RN1.3 SD_Card.2), SINUX_V3_MAIN (U6.102)
SDC1_CLK: SINUX_V3_IO (header.13), SINUX_V3_MAIN (U6.5)
SDC1_CMD: SINUX_V3_IO (header.14), SINUX_V3_MAIN (U6.4)
SDC1_D0: SINUX_V3_IO (header.15), SINUX_V3_MAIN (U6.3)
SDC1_D1: SINUX_V3_IO (header.16), SINUX_V3_MAIN (U6.2)
SDC1_D2: SINUX_V3_IO (header.17), SINUX_V3_MAIN (U6.1)
SDC1_D3: SINUX_V3_IO (header.18), SINUX_V3_MAIN (U6.128)
SPI_CLK: SINUX_V3_IO (header.25 U5.6), SINUX_V3_MAIN (U6.53)
SPI_CS: SINUX_V3_IO (header.26 R19.2), SINUX_V3_MAIN (U6.54)
SPI_MISO: SINUX_V3_IO (header.24 U5.2), SINUX_V3_MAIN (U6.52)
SPI_MOSI: SINUX_V3_IO (header.23 U5.5), SINUX_V3_MAIN (U6.55)
SVREF: SINUX_V3_MAIN (U6.63 U6.71), SINUX_V3_POWER (C53.1 C54.2 R35.1 R36.2)
TWI0_SCK: SINUX_V3_IO (header.6 R37.1 touch.6 U4.10), SINUX_V3_MAIN (U6.45)
TWI0_SDA: SINUX_V3_IO (header.5 R38.1 touch.5 U4.9), SINUX_V3_MAIN (U6.46)
UART0_RX: SINUX_V3_IO (header.22), SINUX_V3_MAIN (U6.49)
UART0_TX: SINUX_V3_IO (header.20), SINUX_V3_MAIN (U6.48)
UART2_RX: SINUX_V3_IO (header.8), SINUX_V3_MAIN (U6.40)
UART2_TX: SINUX_V3_IO (header.7), SINUX_V3_MAIN (U6.39)
USB_ID: SINUX_V3_IO (MICRO_USB.4 R30.2), SINUX_V3_MAIN (U6.100)
USBD_N: SINUX_V3_IO (MICRO_USB.2), SINUX_V3_MAIN (U6.110)
USBD_P: SINUX_V3_IO (MICRO_USB.3), SINUX_V3_MAIN (U6.111)